# Altium project StLinkV3.PrjPcb
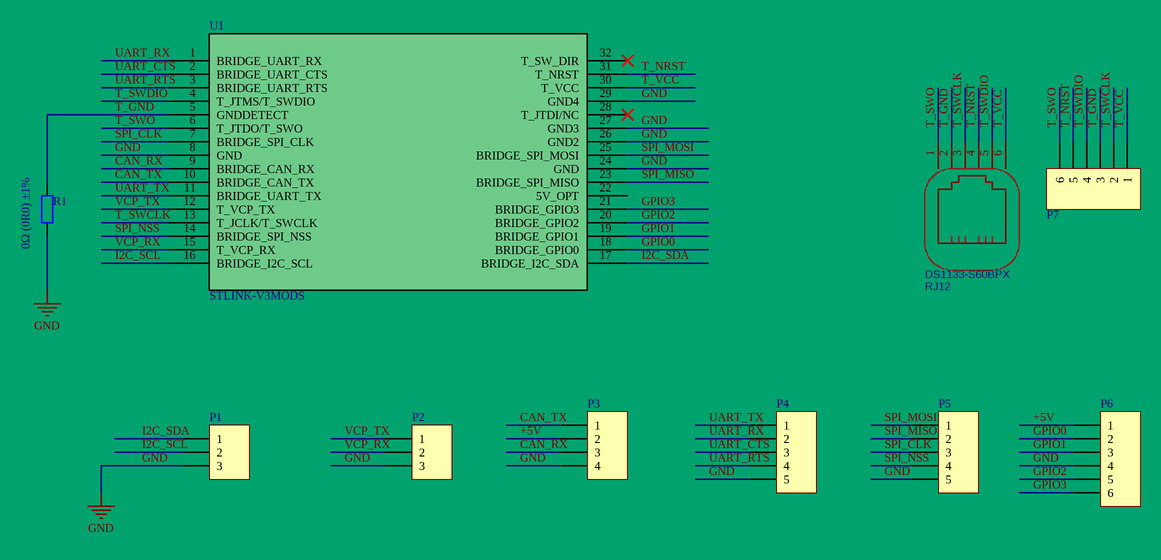
[diagram p0: STM32_V3LINKMOD.SchDoc]
1 sheet, 10 parts. Net scope: global (net labels, ports and power ports of the same name join across sheets).
Board file: StLinkV3.PcbDoc

## Sheet STM32_V3LINKMOD.SchDoc
size A4

### Parts
DS1133-S60BPX  RJ12  [RJ11-TH_DS1133-S60BPX]
P1  Header 3  [HDR1X3]  (value not drawn)
P2  Header 3  [HDR1X3]  (value not drawn)
P3  Header 4  [HDR1X4]  (value not drawn)
P4  Header 5  [HDR1X5]  (value not drawn)
P5  Header 5  [HDR1X5]  (value not drawn)
P6  Header 6  [HDR1X6]  (value not drawn)
P7  Header 6  [HDR1X6]  (value not drawn)
R1  0Ω (0R0) ±1%  [0805_R]
U1  STLINK-V3MODS  [mod_stlink-v3m_m]

### Nets
GND: P1.3 P2.3 P3.4 P4.5 P5.5 P6.4 R1.1 U1.8(GND) U1.24(GND) U1.26(GND2) U1.27(GND3) U1.29(GND4)
+5V: P3.2 P6.1
CAN_RX: P3.3 U1.9(BRIDGE_CAN_RX)
CAN_TX: P3.1 U1.10(BRIDGE_CAN_TX)
GPIO0: P6.2 U1.18(BRIDGE_GPIO0)
GPIO1: P6.3 U1.19(BRIDGE_GPIO1)
GPIO2: P6.5 U1.20(BRIDGE_GPIO2)
GPIO3: P6.6 U1.21(BRIDGE_GPIO3)
I2C_SCL: P1.2 U1.16(BRIDGE_I2C_SCL)
I2C_SDA: P1.1 U1.17(BRIDGE_I2C_SDA)
SPI_CLK: P5.3 U1.7(BRIDGE_SPI_CLK)
SPI_MISO: P5.2 U1.23(BRIDGE_SPI_MISO)
SPI_MOSI: P5.1 U1.25(BRIDGE_SPI_MOSI)
SPI_NSS: P5.4 U1.14(BRIDGE_SPI_NSS)
T_GND: DS1133-S60BPX.2 P7.3 R1.2 U1.5(GNDDETECT)
T_NRST: DS1133-S60BPX.4 P7.5 U1.31(T_NRST)
T_SWCLK: DS1133-S60BPX.3 P7.2 U1.13(T_JCLK/T_SWCLK)
T_SWDIO: DS1133-S60BPX.5 P7.4 U1.4(T_JTMS/T_SWDIO)
T_SWO: DS1133-S60BPX.1 P7.6 U1.6(T_JTDO/T_SWO)
T_VCC: DS1133-S60BPX.6 P7.1 U1.30(T_VCC)
UART_CTS: P4.3 U1.2(BRIDGE_UART_CTS)
UART_RTS: P4.4 U1.3(BRIDGE_UART_RTS)
UART_RX: P4.2 U1.1(BRIDGE_UART_RX)
UART_TX: P4.1 U1.11(BRIDGE_UART_TX)
VCP_RX: P2.2 U1.15(T_VCP_RX)
VCP_TX: P2.1 U1.12(T_VCP_TX)

Not connected (* = marked no-connect by the designer): U1 22(5V_OPT) 28(T_JTDI/NC)* 32(T_SW_DIR)*

### Library data of the parts
DS1133-S60BPX = RJ12-DS1133-S60BPX: BOM_Manufacturer: CONNFLY; BOM_Supplier: LCSC; BOM_Manufacturer Part: DS1133-S60BPX; BOM_Supplier Part: C77859; spicePre: R; spiceSymbolName: DS1133-S60BPX
P1 P2 = Header 3: Header, 3-Pin; LatestRevisionDate: 17-Jul-2002; LatestRevisionNote: Re-released for DXP Platform.; Publisher: Altium Limited
P3 = Header 4: Header, 4-Pin; LatestRevisionDate: 17-Jul-2002; LatestRevisionNote: Re-released for DXP Platform.; Publisher: Altium Limited
P4 P5 = Header 5: Header, 5-Pin; LatestRevisionDate: 17-Jul-2002; LatestRevisionNote: Re-released for DXP Platform.; Publisher: Altium Limited
P6 P7 = Header 6: Header, 6-Pin; LatestRevisionDate: 17-Jul-2002; LatestRevisionNote: Re-released for DXP Platform.; Publisher: Altium Limited
R1 = 0805 0Ω (0R0) 1%: 贴片电阻; ComponentLink1Description: 供应商链接; ComponentLink1URL: http://www.szlcsc.com/product/details_18165.html; Package: 0805; Supplier: LC; SuppliersPartNumber: C17477
U1 = STLINK-V3MODS: Imported; Manufacturer_Part_Number: STLINK-V3MOS; Built_By: EMA_Rocco; Vendor: STMicroelectronics; Copyright: Copyright (C) 2018 Accelerated Designs. All rights reserved; Value: Value; Type: Type; RefDes: RefDes